# Altium schematic sheet Sheet_3_AnalogHeart.SchDoc
size A; SheetNumber: 3; SheetTotal: 3
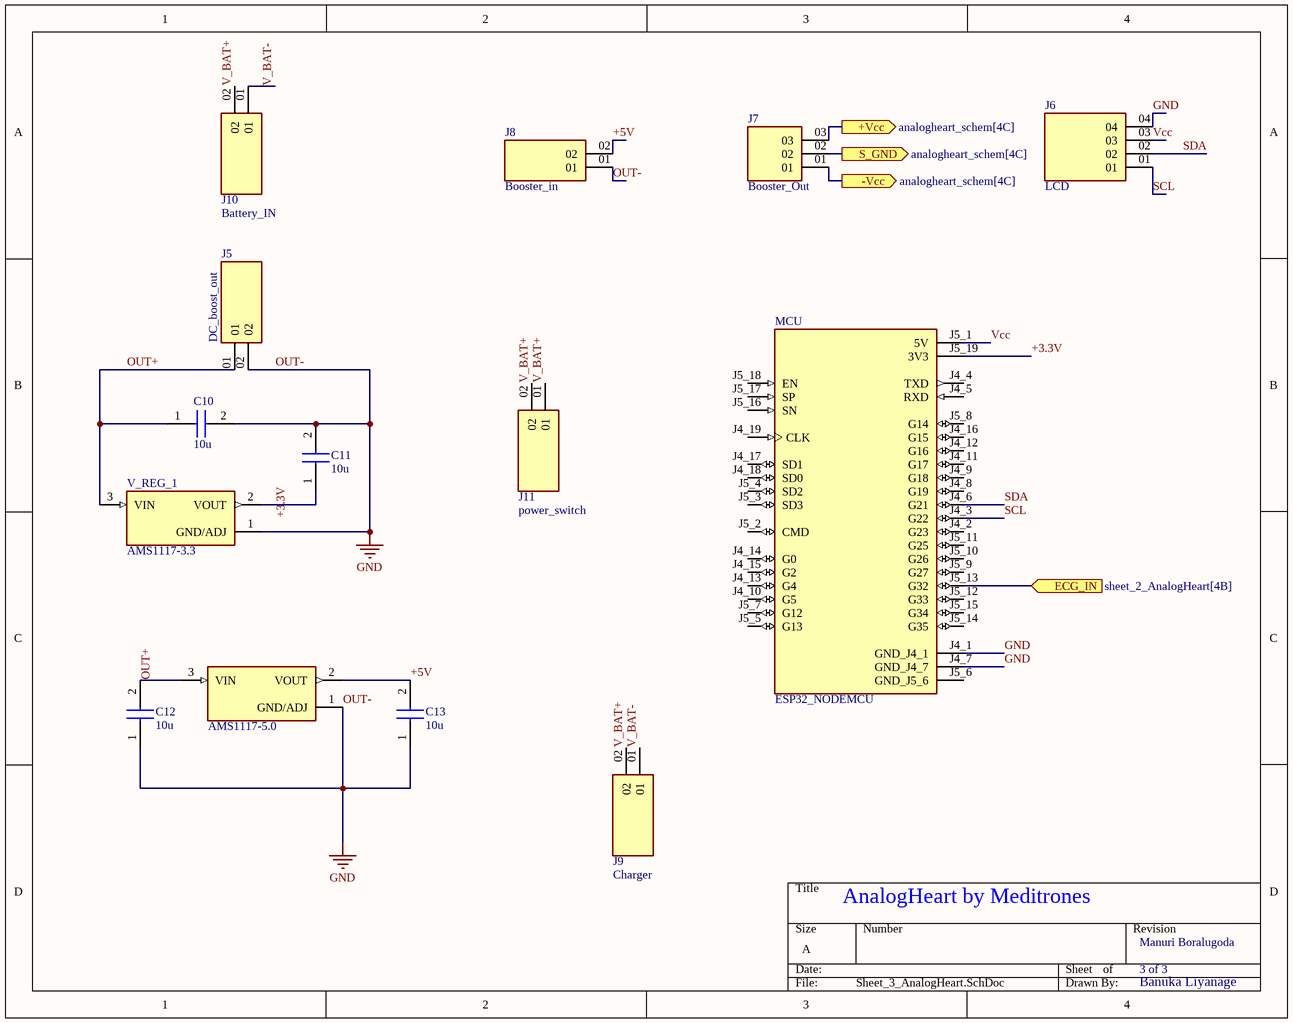
[diagram p0: Sheet_3_AnalogHeart.SchDoc]

## Parts
?  AMS1117-5.0  [SOT229P700X180-4N]
C10  10u  [CAPC2012X94N]
C11  10u  [CAPC2012X94N]
C12  10u  [CAPC2012X94N]
C13  10u  [CAPC2012X94N]
J5  DC_boost_out  [SAMTEC_MTSW-102-11-T-S-640]
J6  LCD  [SAMTEC_MTSW-104-08-G-S-350]
J7  Booster_Out  [SAMTEC_MTLW-103-XX-XX-S-XXX]
J8  Booster_in  [SAMTEC_MTSW-102-11-T-S-640]
J9  Charger  [SAMTEC_MTSW-102-11-T-S-640]
J10  Battery_IN  [SAMTEC_MTSW-102-11-T-S-640]
J11  power_switch  [SAMTEC_MTSW-102-11-T-S-640]
MCU  ESP32_NODEMCU  [MODULE_ESP32_NODEMCU]
V_REG_1  AMS1117-3.3  [SOT229P700X180-4N]

## Ports
+Vcc (out, see analogheart_schem[4C]), -Vcc (out, see analogheart_schem[4C]), ECG_IN (in, see sheet_2_AnalogHeart[4B]), S_GND (out, see analogheart_schem[4C])

## Nets
GND: ?.1(GND/ADJ) C10.2 C11.2 C12.1 C13.1 J5.02 J6.04 J8.01 MCU.J4_1(GND_J4_1) MCU.J4_7(GND_J4_7) V_REG_1.1(GND/ADJ)  [also labelled OUT-]
+3.3V: MCU.J5_19(3V3)
+5V: ?.2(VOUT) C13.2 J8.02
+Vcc: J7.03 ; port +Vcc
-Vcc: J7.01 ; port -Vcc
ECG_IN: MCU.J5_13(G32) ; port ECG_IN
OUT+: ?.3(VIN) C10.1 C12.2 J5.01 V_REG_1.3(VIN)
S_GND: J7.02 ; port S_GND
SCL: J6.01 MCU.J4_3(G22)
SDA: J6.02 MCU.J4_6(G21)
V_BAT+: J9.02 J10.02 J11.01 J11.02
V_BAT-: J9.01 J10.01
Vcc: J6.03 MCU.J5_1(5V)
NetC11_1: C11.1 V_REG_1.2(VOUT)

Not connected (* = marked no-connect by the designer): MCU J4_2(G23) J4_4(TXD) J4_5(RXD) J4_8(G19) J4_9(G18) J4_10(G5) J4_11(G17) J4_12(G16) J4_13(G4) J4_14(G0) J4_15(G2) J4_16(G15) J4_17(SD1) J4_18(SD0) J4_19(CLK) J5_2(CMD) J5_3(SD3) J5_4(SD2) J5_5(G13) J5_6(GND_J5_6) J5_7(G12) J5_8(G14) J5_9(G27) J5_10(G26) J5_11(G25) J5_12(G33) J5_14(G35) J5_15(G34) J5_16(SN) J5_17(SP) J5_18(EN)

## Notes on the sheet
- AnalogHeart by Meditrones
- 3 of 3
- Manuri Boralugoda
- Banuka Liyanage
- Labels drawn without touching a wire or pin: +3.3V

## Library data of the parts
? = AMS1117-5.0: 1A LOW DROPOUT VOLTAGE REGULATOR; MF: ams; MP: AMS1117-5.0; Package: SOT-223 Seeed Technology; SnapEDA_Link: https://www.snapeda.com/parts/AMS1117-5.0/ams/view-part/?ref=snap; Check_prices: https://www.snapeda.com/parts/AMS1117-5.0/ams/view-part/?ref=eda; Availability: Not in stock; Value: *; Price: None
C10-C13 = 08055A331FAT2A: Capacitor; Manufacturer_Name: Kyocera AVX; Datasheet Link: https://componentsearchengine.com/Datasheets/1/06031A100FAT2A.pdf; Height: 0.94mm; Manufacturer_Part_Number: 08055A331FAT2A; Mouser Part Number: 581-08055A331FAT2A; Mouser Price/Stock: https://www.mouser.com/Search/Refine.aspx?Keyword=581-08055A331FAT2A; Arrow Part Number: 08055A331FAT2A; Arrow Price/Stock: https://www.arrow.com/en/products/08055a331fat2a/avx
J5 J8-J11 = MTSW-102-11-T-S-640: Package: None; Price: None; MP: MTSW-102-11-T-S-640; Availability: Unavailable; Value: *
J6 = MTSW-104-08-G-S-350: CONN HEADER VERT 4POS 2.54MM; MF: Samtec; SnapEDA_Link: https://www.snapeda.com/parts/MTSW-104-08-G-S-350/Samtec/view-part/?ref=snap; Package: None; Value: *; MP: MTSW-104-08-G-S-350; Check_prices: https://www.snapeda.com/parts/MTSW-104-08-G-S-350/Samtec/view-part/?ref=eda
J7 = MTLW-103-XX-XX-S-XXX: Connector Header Through Hole 40 position 0.100" (2.54mm); Package: None; Price: None; Value: *; MP: MTLW-103-XX-XX-S-XXX; Availability: Unavailable
MCU = ESP32_NODEMCU: NodeMCU is an open source loT platform. ESP32 is a series of low cost, low powersystem-on-chip (SoC) microcontrollers with integrated Wi-Fi & dual-mode Bluetooth.; MF: Espressif Systems; MP: ESP32 NODEMCU; SnapEDA_Link: https://www.snapeda.com/parts/ESP32%20NODEMCU/Espressif+Systems/view-part/?ref=snap; Package: Package; Value: *; Check_prices: https://www.snapeda.com/parts/ESP32%20NODEMCU/Espressif+Systems/view-part/?ref=eda
V_REG_1 = AMS1117-3.3: Sot223/Pkg 1-Amp 3.3-Volt Low Drop Out Voltage Regulatator; MF: Advanced Monolithic Systems; Package: SOT-223 Seeed Technology; Value: *; Check_prices: https://www.snapeda.com/parts/AMS1117-3.3/Advanced+Monolithic+Systems/view-part/?ref=eda; Price: None; Availability: Not in stock; MP: AMS1117-3.3; SnapEDA_Link: https://www.snapeda.com/parts/AMS1117-3.3/Advanced+Monolithic+Systems/view-part/?ref=snap